# Altium project sensors_0v2.PrjPCB
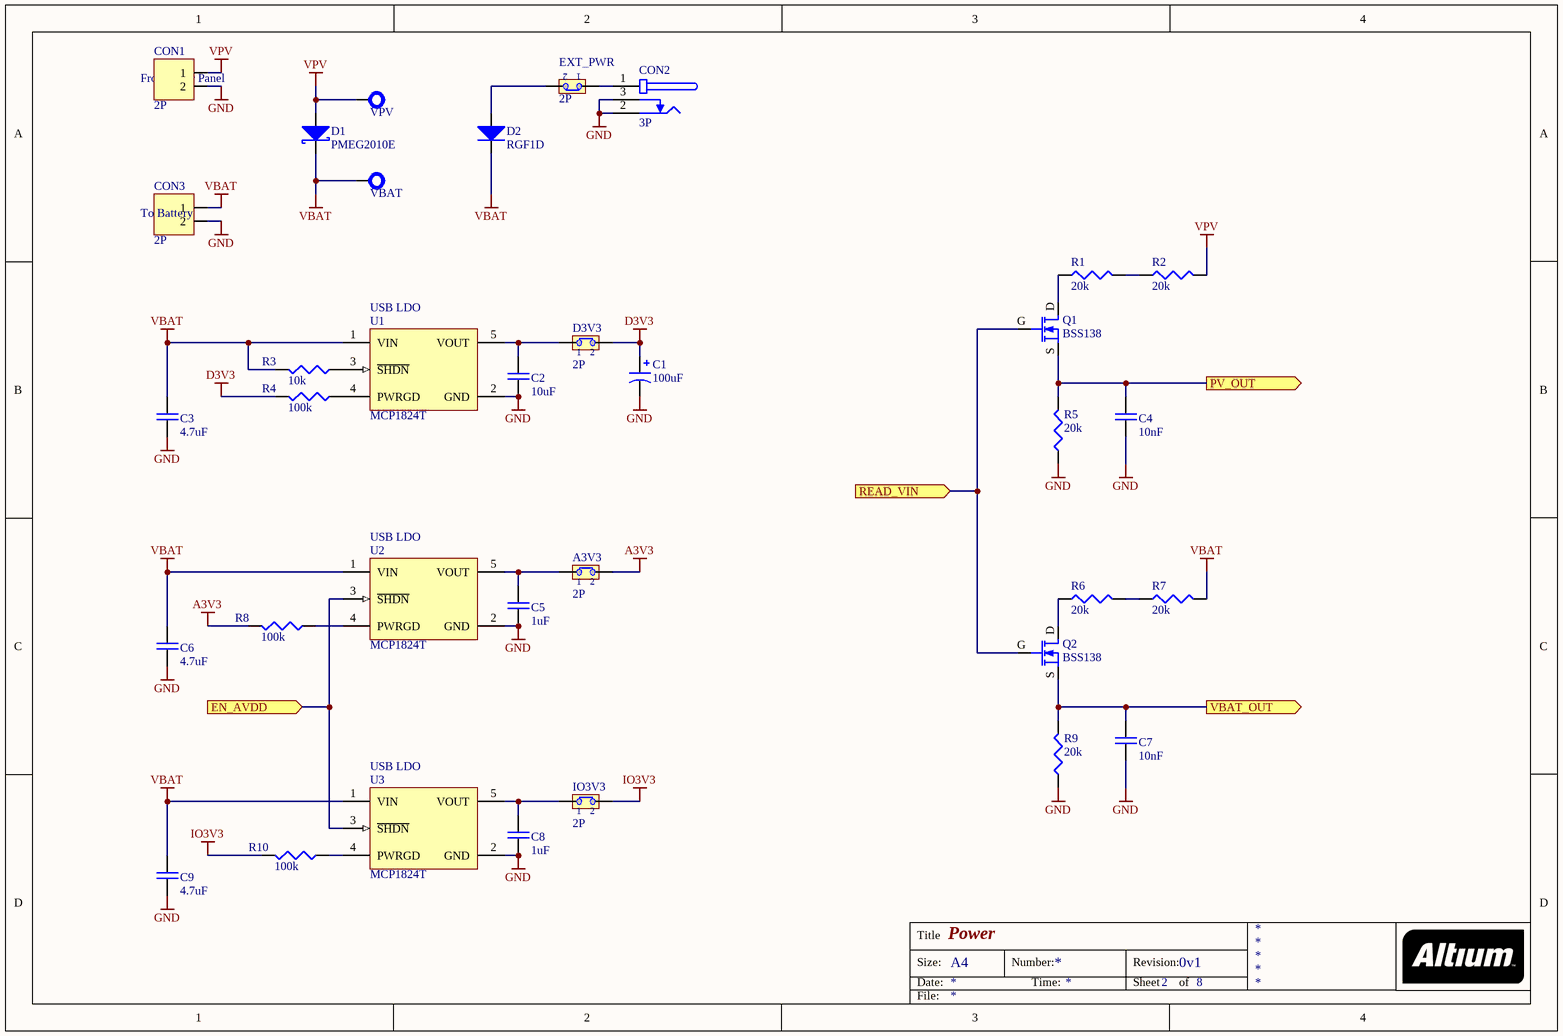
[diagram p0: power.SchDoc]
5 sheets, 144 parts. Net scope: flat (ports and power ports of the same name join across sheets).
Board file: sensors_0v2.PcbDoc
Sheets:
  power.SchDoc
  atmega128rf.SchDoc
  humidity.SchDoc
  uv.SchDoc
  weatherstation.SchDoc

## Sheet power.SchDoc: Power
size A4; CheckedBy: rrodrigu; Author: Satxo; CompanyName: Satxo; Revision: 0v1; SheetNumber: 2; SheetTotal: 8; ProjectName: Basestation

### Parts
A3V3  2P  [SIP-2]
C1  100uF  [RADIAL-2.5MM]
C2  10uF  [0805]
C3  4.7uF  [0805]
C4  10nF  [0603]
C5  1uF  [0805]
C6  4.7uF  [0805]
C7  10nF  [0603]
C8  1uF  [0805]
C9  4.7uF  [0805]
CON1  2P  [JST-2MM]
CON2  3P  [JACKPOW/PD-2.5MM-TH]
CON3  2P  [INTERLOCK2-5MM]
D1  PMEG2010E  [SOD-123]
D2  RGF1D  [DO-214BA]
D3V3  2P  [SIP-2]
EXT_PWR  2P  [SIP-2]
IO3V3  2P  [SIP-2]
Q1  BSS138  [SOT-23@GSD]
Q2  BSS138  [SOT-23@GSD]
R1  20k  [0603]
R2  20k  [0603]
R3  10k  [0603]
R4  100k  [0603]
R5  20k  [0603]
R6  20k  [0603]
R7  20k  [0603]
R8  100k  [0603]
R9  20k  [0603]
R10  100k  [0603]
U1  MCP1824T  [SOT-23-5]
U2  MCP1824T  [SOT-23-5]
U3  MCP1824T  [SOT-23-5]
VBAT  Test Point  [TERMINAL]  (value not drawn)  (no BOM)
VPV  Test Point  [TERMINAL]  (value not drawn)  (no BOM)

### Ports
EN_AVDD (in), PV_OUT (out), READ_VIN (in), VBAT_OUT (out)

### Nets
A3V3: A3V3.2 R8.2
D3V3: C1.1(P) D3V3.2 R4.2
GND: C1.2(N) C2.1 C3.1 C4.1 C5.1 C6.1 C7.1 C8.1 C9.1 CON1.2 CON2.2 CON2.3 CON3.2 R5.1 R9.1 U1.2(GND) U2.2(GND) U3.2(GND)
IO3V3: IO3V3.2 R10.2
VBAT: C3.2 C6.2 C9.2 CON3.1 D1.K D2.K R3.2 R7.2 U1.1(VIN) U2.1(VIN) U3.1(VIN) VBAT.1(TP)
VPV: CON1.1 D1.A R2.2 VPV.1(TP)
EN_AVDD: U2.3(~{SHDN}) U3.3(~{SHDN}) ; port EN_AVDD
PV_OUT: C4.2 Q1.S R5.2 ; port PV_OUT
READ_VIN: Q1.G Q2.G ; port READ_VIN
VBAT_OUT: C7.2 Q2.S R9.2 ; port VBAT_OUT
NetA3V3_1: A3V3.1 C5.2 U2.5(VOUT)
NetC2_2: C2.2 D3V3.1 U1.5(VOUT)
NetC8_2: C8.2 IO3V3.1 U3.5(VOUT)
NetCON2_1: CON2.1 EXT_PWR.1
NetD2_A: D2.A EXT_PWR.2
NetQ1_D: Q1.D R1.1
NetQ2_D: Q2.D R6.1
NetR1_2: R1.2 R2.1
NetR3_1: R3.1 U1.3(~{SHDN})
NetR4_1: R4.1 U1.4(PWRGD)
NetR6_2: R6.2 R7.1
NetR8_1: R8.1 U2.4(PWRGD)
NetR10_1: R10.1 U3.4(PWRGD)

### Notes on the sheet
- From Solar Panel
- To Battery
- (near U1) USB LDO
- (near U2) USB LDO
- (near U3) USB LDO
- Title
- Size:
- Date:
- A4
- Number:
- Time:
- Revision:
- Sheet
- of
- File:

### Library data of the parts
A3V3 EXT_PWR IO3V3 = JMP2: 2-pin Jumper; Owner: Nuno Brum; Sub-Type: Connector; STATE1: 1; Assembly: INS; Validation Date: 2006-05-15; Creation Date: 2002-07-17; Status: Valid; Type: Electrical & Mechanical
C1 = CAP POL: Polarized Capacitor; Owner: Nuno Brum; Sub-Type: Tantalum; Assembly: INS; Validation date: 2006-05-15; Creation Date: 2005-04-28; Status: Valid; Type: Capacitor
C2-C9 = CAP: Capacitor; Owner: Nuno Brum; Sub-Type: Ceramic; Assembly: INS; Maximum Voltage: *; Creation Date: 2005-04-28; Status: Valid; Validation date: 2006-05-15; Type: Capacitor
CON1 CON3 = CON02: Connector 2 pins; Owner: Rui Rebelo; Assembly: INS; Sub-Type: Connector; Creation Date: 2005-05-27; Status: Valid; Validation Date: 2006-05-15; Type: Electrical & Mechanical
CON2 = JACK POWER PD: Jack Power with insertion detect; Sub-Type: Connector; Owner: Gonçalo Costa; Assembly: INS; Creation Date: 2005-12-05; Status: New; Type: Electrical & Mechanical
D1 = Diode Schottky: Small Signal Schottky Diode; Owner: Nuno Brum; Assembly: INS; Validation date: 2006-05-15; Creation Date: 2001-06-05; Sub-Type: Schottky; Status: Valid; Model: PMEG2010E; Type: Diode
D2 = Diode: Vishay Standard Avalanche Sinterglass Diode; Owner: Nuno Brum; Sub-Type: Generic; Assembly: INS; Validation date: 2006-05-15; Creation Date: 2001-06-05; Status: Valid; Model: RGF1D; Type: Diode
D3V3 = JMP2: 2-pin Jumper; Owner: Nuno Brum; Sub-Type: Connector; STATE1: 1; Type: Electrical & Mechanical; Assembly: INS; Validation Date: 2006-05-15; Creation Date: 2002-07-17; Status: Valid
Q1 Q2 = MOSFET-N: N-Channel Logic Level Enhancement Mode Field Effect Transistor; pin to pad: 2>3 3>2; Owner: Nuno Brum; Sub-Type: MOSFET; Assembly: INS; Creation Date: 2001-06-05; Status: Valid; Model: BSS138; Type: Transistor
R1-R10 = RES: Resistor; Owner: Nuno Brum; Sub-Type: Generic; Assembly: INS; Validation date: 2006-05-15; Creation Date: 2002-07-17; Status: Valid; Power: *; Type: Resistor
U1-U3 = MCP1824T: 300 mA, Low Voltage, Low Quiescent Current LDO Regulator, 5-Pin SOT-23, Extended Temperature, Tape and Reel; Published: 29-Jan-2009; DatasheetVersion: revA, Aug-2007; PackageVersion: revBB, Aug-2009; PackageReference: SOT-23-OT5; Publisher: Altium Limited; PackageDescription: 5-Lead Plastic Small Outline Transistor (OT) [SOT-23]; Supplier 1: Digi-Key; Supplier Part Number 1: MCP1824T-3302E/OTTR-ND; Supplier 2: Digi-Key; Supplier Part Number 2: MCP1824T-3302E/OTCT-ND; Supplier 3: Digi-Key; Supplier Part Number 3: MCP1824T-3302E/OTDKR-ND; Supplier 4: Farnell; Supplier Part Number 4: 1578387; Code_IPC: SOT23-5; ComponentLink1Description: Datasheet; ComponentLink1URL: http://ww1.microchip.com/downloads/en/DeviceDoc/22070a.pdf; ComponentLink2Description: Packaging Specification; ComponentLink2URL: http://www.microchip.com/stellent/groups/techpub_sg/documents/packagingspec/en012702.pdf; ComponentLink3Description: Microchip.com Home; ComponentLink3URL: http://www.microchip.com/
VBAT VPV = TEST-PROBE: Test/Probe Point; Owner: Nuno Brum; Sub-Type: Mechanical; Assembly: PCB; Validation Date: 2006-05-15; Type: PCB; Creation Date: 2005-06-01; Status: Valid

## Sheet atmega128rf.SchDoc: Microcontroller
size A3; CheckedBy: rrodrigu; Author: Satxo; CompanyName: Satxo; Revision: 0v1; SheetNumber: 3; SheetTotal: 8; ProjectName: Basesation
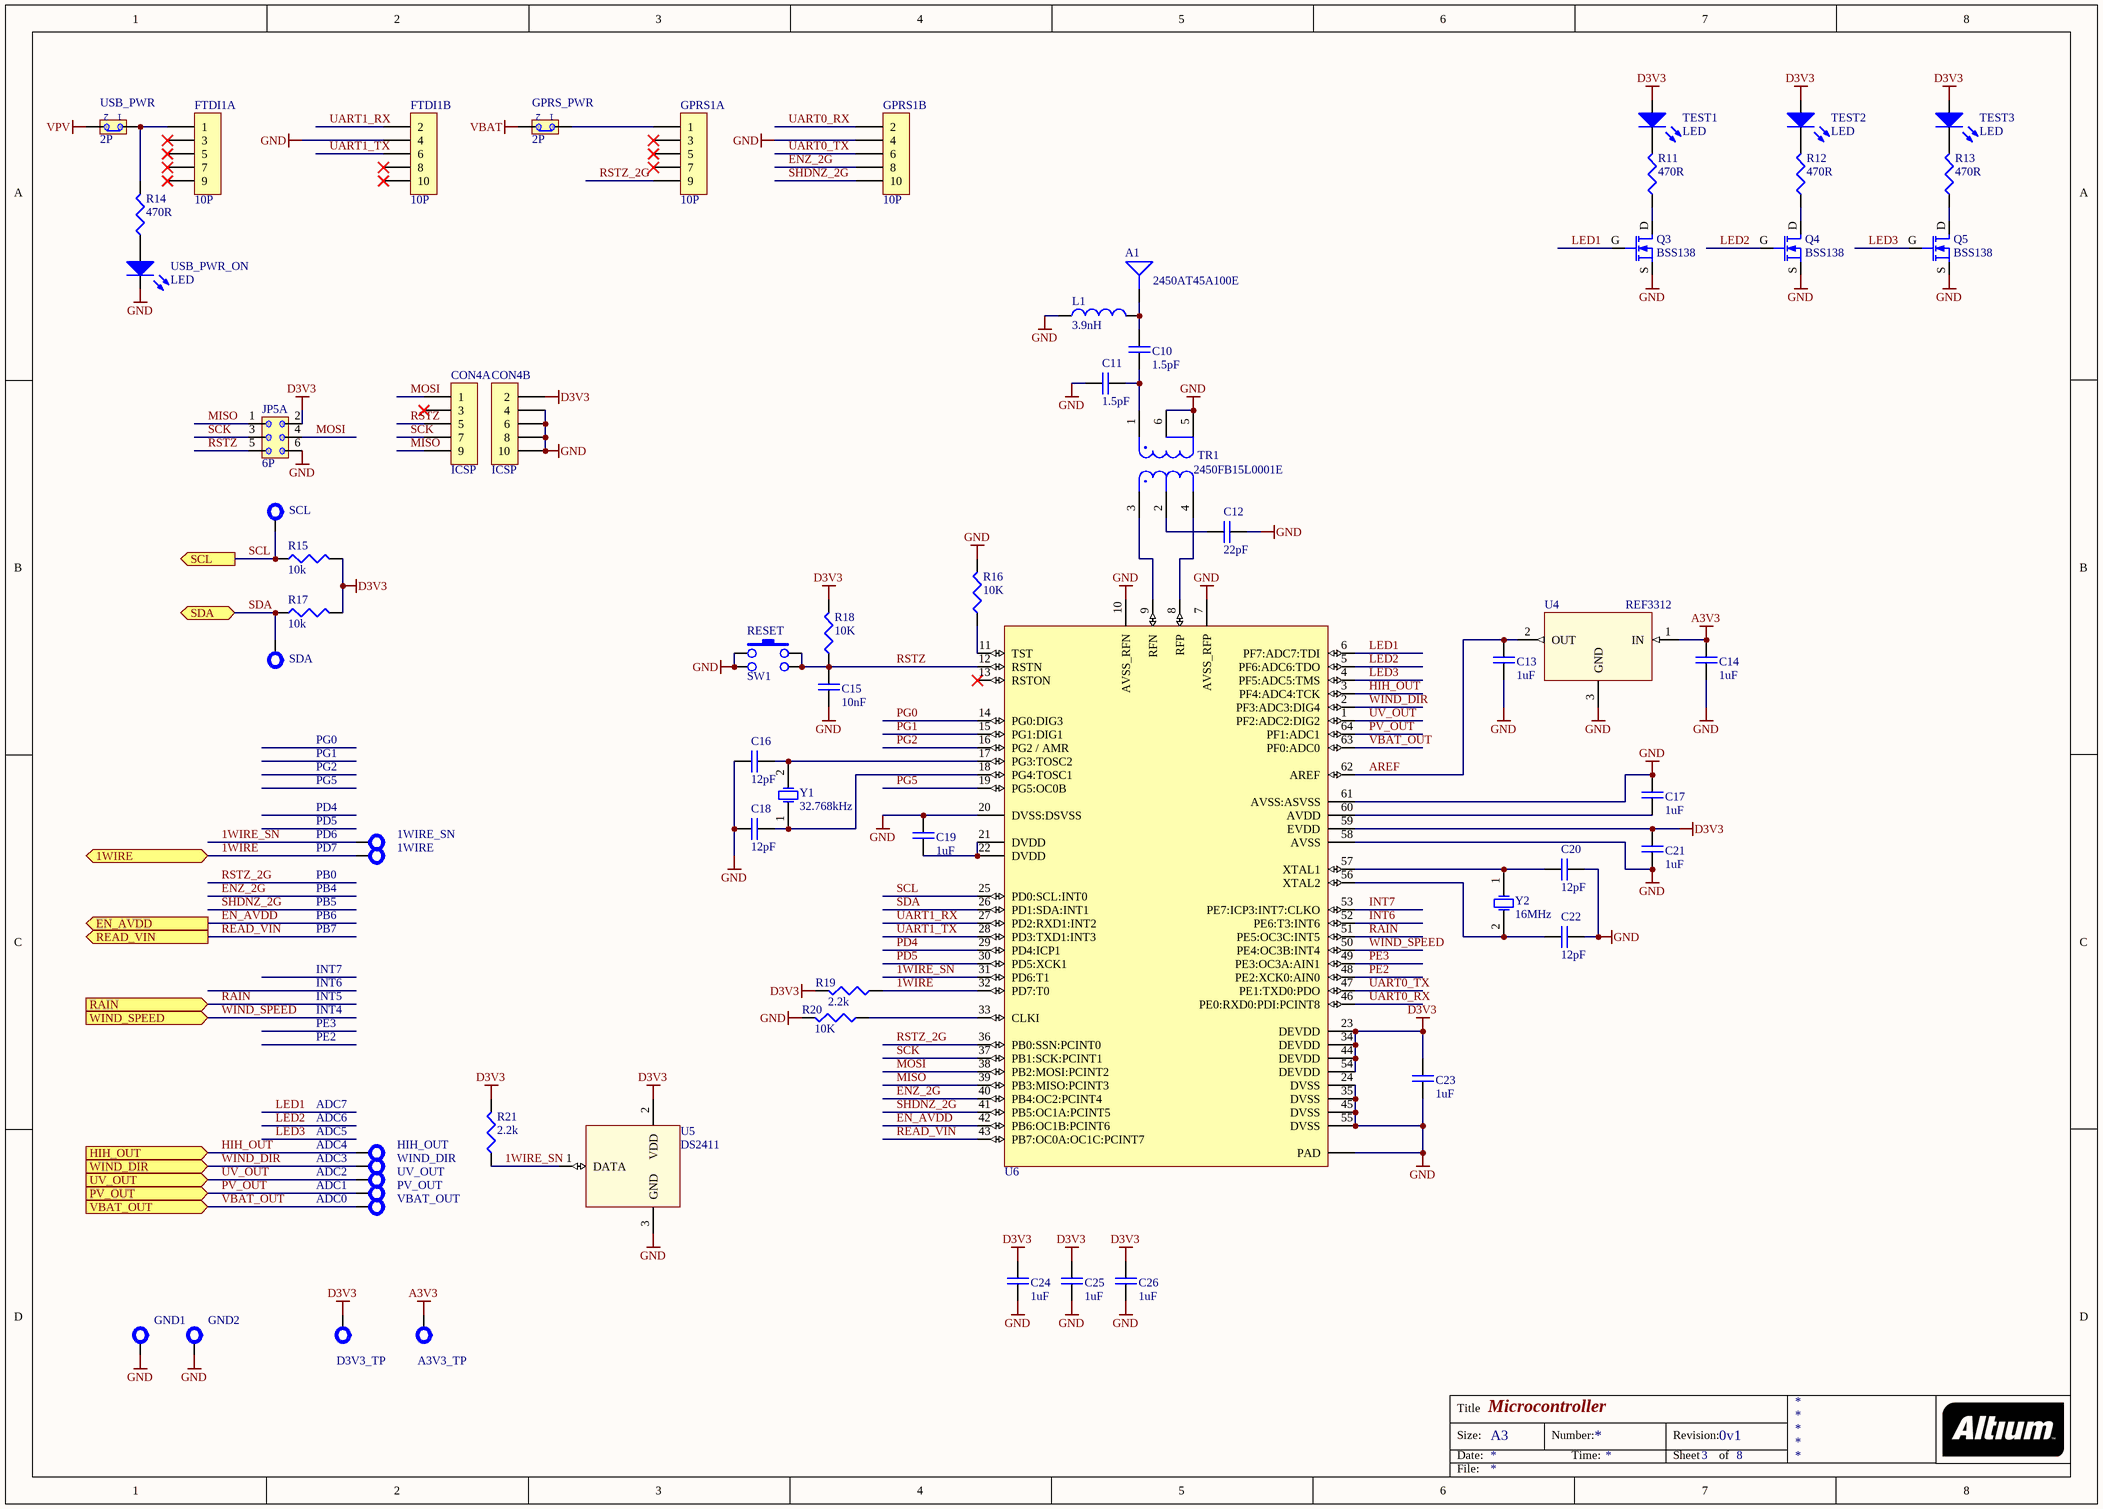
[diagram p1: atmega128rf.SchDoc]

### Parts
1WIRE  Test Point  [TERMINAL]  (value not drawn)  (no BOM)
1WIRE_SN  Test Point  [TERMINAL]  (value not drawn)  (no BOM)
A1  2450AT45A100E  [2450AT45A100E]
A3V3_TP  Test Point  [TERMINAL]  (value not drawn)  (no BOM)
C10  1.5pF  [0402]
C11  1.5pF  [0402]
C12  22pF  [0402]
C13  1uF  [0603]
C14  1uF  [0603]
C15  10nF  [0603]
C16  12pF  [0603]
C17  1uF  [0603]
C18  12pF  [0603]
C19  1uF  [0603]
C20  12pF  [0603]
C21  1uF  [0603]
C22  12pF  [0603]
C23  1uF  [0603]
C24  1uF  [0603]
C25  1uF  [0603]
C26  1uF  [0603]
CON4  ICSP  [IDC-10-F]  (parts A,B of 2)
D3V3_TP  Test Point  [TERMINAL]  (value not drawn)  (no BOM)
FTDI1  10P  [IDC-10-90]  (parts A,B of 2)
GND1  Test Point  [TEST-PROBE2]  (value not drawn)  (no BOM)
GND2  Test Point  [TEST-PROBE2]  (value not drawn)  (no BOM)
GPRS1  10P  [IDC-10-90]  (parts A,B of 2)
GPRS_PWR  2P  [SIP-2]
HIH_OUT  Test Point  [TERMINAL]  (value not drawn)  (no BOM)
JP5  6P  [DIL-6]  (part A of 3)
L1  3.9nH  [0402]
PV_OUT  Test Point  [TERMINAL]  (value not drawn)  (no BOM)
Q3  BSS138  [SOT-23@GSD]
Q4  BSS138  [SOT-23@GSD]
Q5  BSS138  [SOT-23@GSD]
R11  470R  [0603]
R12  470R  [0603]
R13  470R  [0603]
R14  470R  [0603]
R15  10k  [0603]
R16  10K  [0603]
R17  10k  [0603]
R18  10K  [0603]
R19  2.2k  [0603]
R20  10K  [0603]
R21  2.2k  [0603]
RESET  SW1  [MICROSWITCH]
SCL  Test Point  [TERMINAL]  (value not drawn)  (no BOM)
SDA  Test Point  [TERMINAL]  (value not drawn)  (no BOM)
TEST1  LED  [0805@DIODE]
TEST2  LED  [0805@DIODE]
TEST3  LED  [0805@DIODE]
TR1  2450FB15L0001E  [0805@BALUN]
U4  REF3312  [SOT-23]
U5  DS2411  [SOT-23]
U6  ATmega128RFA1  [QFN-64@EP]  (value not drawn)
USB_PWR  2P  [SIP-2]
USB_PWR_ON  LED  [0805@DIODE]
UV_OUT  Test Point  [TERMINAL]  (value not drawn)  (no BOM)
VBAT_OUT  Test Point  [TERMINAL]  (value not drawn)  (no BOM)
WIND_DIR  Test Point  [TERMINAL]  (value not drawn)  (no BOM)
Y1  32.768kHz  [HC-49U]
Y2  16MHz  [HC-49U]

### Ports
1WIRE (bidir), EN_AVDD (out), HIH_OUT (in), PV_OUT (in), RAIN (in), READ_VIN (out), SCL (out), SDA (bidir), UV_OUT (in), VBAT_OUT (in), WIND_DIR (in), WIND_SPEED (in)

### Nets
A3V3: A3V3_TP.1(TP) C14.1 U4.1(IN)
D3V3: C21.2 C23.2 C24.2 C25.2 C26.2 CON4.2 D3V3_TP.1(TP) JP5.2 R15.2 R17.2 R18.2 R19.2 R21.2 TEST1.A TEST2.A TEST3.A U5.2(VDD) U6.23(DEVDD) U6.34(DEVDD) U6.44(DEVDD) U6.54(DEVDD) U6.59(EVDD)
GND: C11.1 C12.2 C13.2 C14.2 C15.2 C16.1 C17.2 C18.1 C19.2 C20.2 C21.1 C22.2 C23.1 C24.1 C25.1 C26.1 CON4.4 CON4.6 CON4.8 CON4.10 FTDI1.4 GND1.1(TP) GND2.1(TP) GPRS1.4 JP5.6 L1.1 Q3.S Q4.S Q5.S R16.2 R20.2 RESET.1 RESET.3 TR1.5(Ground) TR1.6(Ground) U4.3(GND) U5.3(GND) U6.7(AVSS_RFP) U6.10(AVSS_RFN) U6.20(DVSS:DSVSS) U6.24(DVSS) U6.35(DVSS) U6.45(DVSS) U6.55(DVSS) U6.58(AVSS) U6.61(AVSS:ASVSS) U6.PAD USB_PWR_ON.K
VBAT: GPRS_PWR.2
VPV: USB_PWR.2
1WIRE: 1WIRE.1(TP) R19.1 U6.32(PD7:T0) ; port 1WIRE
1WIRE_SN: 1WIRE_SN.1(TP) R21.1 U5.1(DATA) U6.31(PD6:T1)
AREF: C13.1 U4.2(OUT) U6.62(AREF)
EN_AVDD: U6.42(PB6:OC1B:PCINT6) ; port EN_AVDD
ENZ_2G: GPRS1.8 U6.40(PB4:OC2:PCINT4)
HIH_OUT: HIH_OUT.1(TP) U6.3(PF4:ADC4:TCK) ; port HIH_OUT
INT6: U6.52(PE6:T3:INT6)
INT7: U6.53(PE7:ICP3:INT7:CLKO)
LED1: Q3.G U6.6(PF7:ADC7:TDI)
LED2: Q4.G U6.5(PF6:ADC6:TDO)
LED3: Q5.G U6.4(PF5:ADC5:TMS)
MISO: CON4.9 JP5.1 U6.39(PB3:MISO:PCINT3)
MOSI: CON4.1 JP5.4 U6.38(PB2:MOSI:PCINT2)
PD4: U6.29(PD4:ICP1)
PD5: U6.30(PD5:XCK1)
PE2: U6.48(PE2:XCK0:AIN0)
PE3: U6.49(PE3:OC3A:AIN1)
PG0: U6.14(PG0:DIG3)
PG1: U6.15(PG1:DIG1)
PG2: U6.16(PG2_/_AMR)
PG5: U6.19(PG5:OC0B)
PV_OUT: PV_OUT.1(TP) U6.64(PF1:ADC1) ; port PV_OUT
RAIN: U6.51(PE5:OC3C:INT5) ; port RAIN
READ_VIN: U6.43(PB7:OC0A:OC1C:PCINT7) ; port READ_VIN
RSTZ: C15.1 CON4.5 JP5.5 R18.1 RESET.2 RESET.4 U6.12(RSTN)
RSTZ_2G: GPRS1.9 U6.36(PB0:SSN:PCINT0)
SCK: CON4.7 JP5.3 U6.37(PB1:SCK:PCINT1)
SCL: R15.1 SCL.1(TP) U6.25(PD0:SCL:INT0) ; port SCL
SDA: R17.1 SDA.1(TP) U6.26(PD1:SDA:INT1) ; port SDA
SHDNZ_2G: GPRS1.10 U6.41(PB5:OC1A:PCINT5)
UART0_RX: GPRS1.2 U6.46(PE0:RXD0:PDI:PCINT8)
UART0_TX: GPRS1.6 U6.47(PE1:TXD0:PDO)
UART1_RX: FTDI1.2 U6.27(PD2:RXD1:INT2)
UART1_TX: FTDI1.6 U6.28(PD3:TXD1:INT3)
UV_OUT: U6.1(PF2:ADC2:DIG2) UV_OUT.1(TP) ; port UV_OUT
VBAT_OUT: U6.63(PF0:ADC0) VBAT_OUT.1(TP) ; port VBAT_OUT
WIND_DIR: U6.2(PF3:ADC3:DIG4) WIND_DIR.1(TP) ; port WIND_DIR
WIND_SPEED: U6.50(PE4:OC3B:INT4) ; port WIND_SPEED
NetA1_1: A1.1 C10.2 L1.2
NetC10_1: C10.1 C11.2 TR1.1(Unbalanced_Port)
NetC12_1: C12.1 TR1.2(DC_Feed_+_RF_GND)
NetC16_2: C16.2 U6.17(PG3:TOSC2) Y1.2(OSC2)
NetC17_1: C17.1 U6.60(AVDD)
NetC18_2: C18.2 U6.18(PG4:TOSC1) Y1.1(OSC1)
NetC19_1: C19.1 U6.21(DVDD) U6.22(DVDD)
NetC20_1: C20.1 U6.57(XTAL1) Y2.1(OSC1)
NetC22_1: C22.1 U6.56(XTAL2) Y2.2(OSC2)
NetFTDI1_1: FTDI1.1 R14.2 USB_PWR.1
NetGPRS1_1: GPRS1.1 GPRS_PWR.1
NetQ3_D: Q3.D R11.1
NetQ4_D: Q4.D R12.1
NetQ5_D: Q5.D R13.1
NetR11_2: R11.2 TEST1.K
NetR12_2: R12.2 TEST2.K
NetR13_2: R13.2 TEST3.K
NetR14_1: R14.1 USB_PWR_ON.A
NetR16_1: R16.1 U6.11(TST)
NetR20_1: R20.1 U6.33(CLKI)
NetTR1_3: TR1.3(Balanced_Port) U6.9(RFN)
NetTR1_4: TR1.4(Balanced_Port) U6.8(RFP)

Not connected (* = marked no-connect by the designer): CON4 3*; FTDI1 3* 5* 7* 8* 9* 10*; GPRS1 3* 5* 7*; U6 13(RSTON)*

### Notes on the sheet
- PG0
- PG1
- PG2
- PG5
- PD4
- PD5
- PD6
- PD7
- PB0
- PB4
- PB5
- PB6
- INT6
- INT7
- PB7
- PE2
- PE3
- INT4
- INT5
- ADC6
- ADC7
- ADC1
- ADC2
- ADC3
- ADC4
- ADC5
- ADC0
- Title
- Size:
- Date:
- A3
- Number:
- Time:
- Revision:
- Sheet
- of
- File:

### Library data of the parts
1WIRE 1WIRE_SN A3V3_TP GND1 GND2 HIH_OUT PV_OUT SCL SDA UV_OUT VBAT_OUT WIND_DIR = TEST-PROBE: as VBAT on sheet power; Validation Date: 2006-05-15; Type: PCB; Creation Date: 2005-06-01; Status: Valid
A1 = Antenna SE: ANTENNA
C10-C26 = CAP: as C2 on sheet power; Maximum Voltage: *; Creation Date: 2005-04-28; Status: Valid; Validation date: 2006-05-15; Type: Capacitor
CON4 FTDI1 GPRS1 = CON10: Connector 10 Pins; Owner: António Silva; Assembly: INS; Sub-Type: Connector; Creation Date: 2005-11-21; Status: Valid; Validation Date: 2006-05-15; Type: Electrical & Mechanical
D3V3_TP = TEST-PROBE: Test/Probe Point; Owner: Nuno Brum; Type: PCB; Sub-Type: Mechanical; Validation Date: 2006-05-15; Creation Date: 2005-06-01; Status: Valid; Assembly: PCB
GPRS_PWR USB_PWR = JMP2: as A3V3 on sheet power; Validation Date: 2006-05-15; Creation Date: 2002-07-17; Status: Valid; Type: Electrical & Mechanical
JP5 = JMP6: 6-Pin Jumper; Sub-Type: Connector; Owner: Rui Rebelo; Assembly: INS; Creation Date: 2005-07-17; Status: Valid; Validation Date: 2006-05-15; Type: Electrical & Mechanical
L1 = IND: Inductor; Owner: Nuno Brum; Sub-Type: Generic; Assembly: INS; Validation date: 2006-05-15; Creation Date: 2002-07-17; Status: Valid; Type: Inductor
Q3-Q5 = MOSFET-N: N-Channel Logic Level Enhancement Mode Field Effect Transistor; pin to pad: 2>3 3>2; Owner: Nuno Brum; Sub-Type: MOSFET; Assembly: INS; Creation Date: 2001-06-05; Status: Valid; Model: BSS138; Type: Transistor
R11-R21 = RES: as R1 on sheet power; Validation date: 2006-05-15; Creation Date: 2002-07-17; Status: Valid; Power: *; Type: Resistor
RESET = SW1: Switch Push Button; Owner: Nuno Brum; Assembly: INS; Validation Date: 2006-05-15; Sub-Type: Switch; Creation Date: 2002-07-17; Status: Valid; Type: Electrical & Mechanical
TEST1-TEST3 USB_PWR_ON = LED: Light emitting diode; Owner: Nuno Brum; Assembly: INS; Creation Date: 2001-06-05; Sub-Type: LED; Status: Valid; Validation date: 2006-05-15; Model: LED; Type: Diode
TR1 = 2450FB15L0001E: FILTER BALUN ATMEL 2.45GHZ; Owner: Rui Rebelo; Sub-Type: Transformer; Type: Electrical & Mechanical; Assembly: INS; Creation Date: 2002-07-25; Status: New
U4 = REF3312: Voltage Reference 1.25V, 30ppm/degC, 5mA; Type: IC; Creation Date: 2012-12-09
U5 = DS2411: Silicon Serial Number; Type: IC; Creation Date: 2012-12-10
U6 = ATmega128RFA1: 802.15.4 compliant AVR transceiver; verified by: vlarsen; verified date: 2010-12-05; Status: Verified
Y1 Y2 = Crystal Oscillator: Published: 17-Jul-2002; DatasheetDocument: 18-Apr-2000; PackageReference: CSM-7; Publisher: Altium Limited; ComponentLink1Description: Manufacturer Link; ComponentLink1URL: http://www.ecsxtal.com/; ComponentLink2Description: Datasheet; ComponentLink2URL: http://www.ecsxtal.com/pdf3/CSM_7.pdf

## Sheet humidity.SchDoc: Humidity Sensors
size A4; CheckedBy: rrodrigu; Author: Satxo; CompanyName: Satxo; Revision: 0v1; SheetNumber: 4; SheetTotal: 8; ProjectName: Basestation
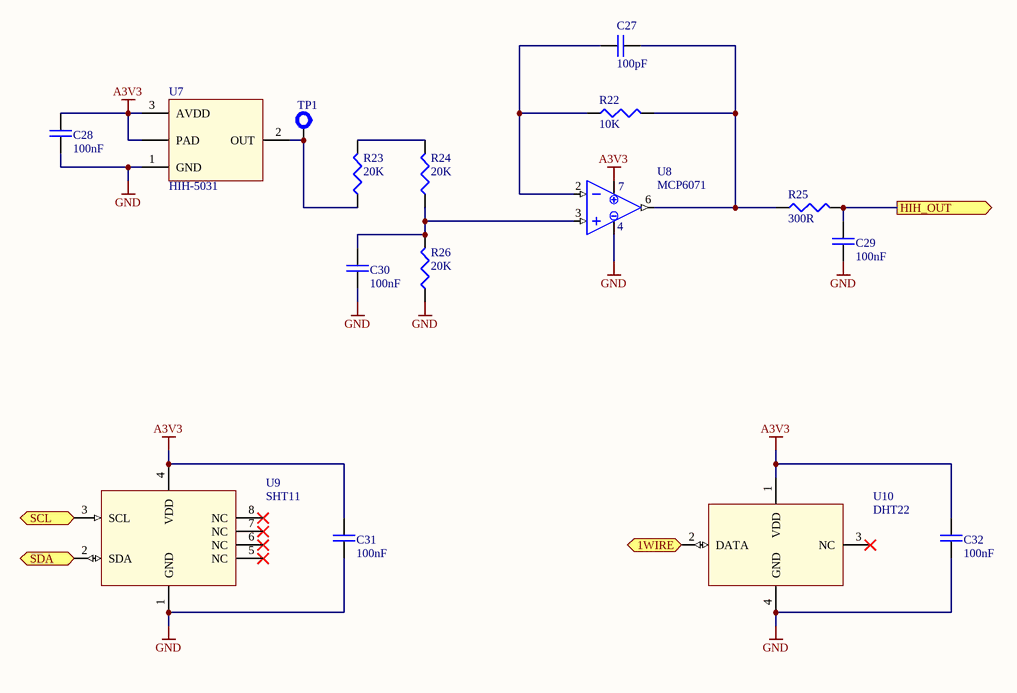
[diagram p2: humidity.SchDoc]

### Parts
C27  100pF  [0603]
C28  100nF  [0603]
C29  100nF  [0603]
C30  100nF  [0603]
C31  100nF  [0603]
C32  100nF  [0603]
R22  10K  [0603]
R23  20K  [0603]
R24  20K  [0603]
R25  300R  [0603]
R26  20K  [0603]
TP1  Test Point  [TERMINAL]  (value not drawn)  (no BOM)
U7  HIH-5031  [HIH]
U8  MCP6071  [SOIC-8]
U9  SHT11  [SHT]
U10  DHT22  [DHT22]

### Ports
1WIRE (bidir), HIH_OUT (out), SCL (in), SDA (bidir)

### Nets
A3V3: C28.2 C31.2 C32.2 U7.3(AVDD) U7.PAD U8.7(VDD) U9.4(VDD) U10.1(VDD)
GND: C28.1 C29.1 C30.1 C31.1 C32.1 R26.1 U7.1(GND) U8.4(VSS) U9.1(GND) U10.4(GND)
1WIRE: U10.2(DATA) ; port 1WIRE
HIH_OUT: C29.2 R25.2 ; port HIH_OUT
SCL: U9.3(SCL) ; port SCL
SDA: U9.2(SDA) ; port SDA
NetC27_1: C27.1 R22.1 U8.2(INN)
NetC27_2: C27.2 R22.2 R25.1 U8.6(VOUT)
NetC30_2: C30.2 R24.1 R26.2 U8.3(INP)
NetR23_1: R23.1 TP1.1(TP) U7.2(OUT)
NetR23_2: R23.2 R24.2

Not connected (* = marked no-connect by the designer): U9 5(NC)* 6(NC)* 7(NC)* 8(NC)*; U10 3(NC)*

### Notes on the sheet
- Title
- Size:
- Date:
- A4
- Number:
- Time:
- Revision:
- Sheet
- of
- File:

### Library data of the parts
C27-C32 = CAP: as C2 on sheet power; Maximum Voltage: *; Creation Date: 2005-04-28; Status: Valid; Validation date: 2006-05-15; Type: Capacitor
R22-R26 = RES: as R1 on sheet power; Validation date: 2006-05-15; Creation Date: 2002-07-17; Status: Valid; Power: *; Type: Resistor
TP1 = TEST-PROBE: as VBAT on sheet power; Validation Date: 2006-05-15; Type: PCB; Creation Date: 2005-06-01; Status: Valid
U7 = HIH-5031: Low Voltage Humidity Sensor; Type: IC; Creation Date: 2012-03-05
U8 = MCP6V26: Low-Offset Opamp; Type: IC; Creation Date: 2012-03-15
U9 = SHT11: Digital Humidity and Temperature Sensor; Type: IC; Creation Date: 2012-12-08
U10 = DHT22: Digital Humidity and Temperature Sensor; Type: IC; Creation Date: 2012-12-09

## Sheet uv.SchDoc: UV Sensor
size A4; CheckedBy: rrodrigu; Author: Satxo; CompanyName: Satxo; Revision: 0v1; SheetNumber: 7; SheetTotal: 8; ProjectName: Basestation
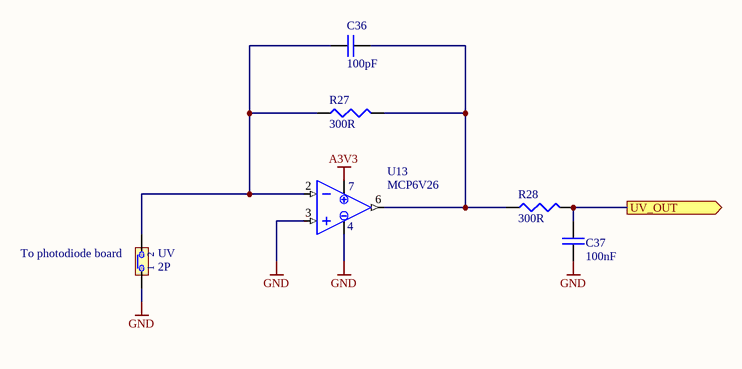
[diagram p3: uv.SchDoc]

### Parts
C36  100pF  [0603]
C37  100nF  [0603]
R27  300R  [0603]
R28  300R  [0603]
U13  MCP6V26  [SOIC-8]
UV  2P  [SIP-2]

### Ports
UV_OUT (out)

### Nets
A3V3: U13.7(VDD)
GND: C37.1 U13.3(INP) U13.4(VSS) UV.1
UV_OUT: C37.2 R28.2 ; port UV_OUT
NetC36_1: C36.1 R27.1 U13.2(INN) UV.2
NetC36_2: C36.2 R27.2 R28.1 U13.6(VOUT)

### Notes on the sheet
- (near UV) To photodiode board
- Title
- Size:
- Date:
- A4
- Number:
- Time:
- Revision:
- Sheet
- of
- File:

### Library data of the parts
C36 C37 = CAP: as C2 on sheet power; Maximum Voltage: *; Creation Date: 2005-04-28; Status: Valid; Validation date: 2006-05-15; Type: Capacitor
R27 R28 = RES: as R1 on sheet power; Validation date: 2006-05-15; Creation Date: 2002-07-17; Status: Valid; Power: *; Type: Resistor
U13 = MCP6V26: Low-Offset Opamp; Type: IC; Creation Date: 2012-03-15
UV = JMP2: as A3V3 on sheet power; Validation Date: 2006-05-15; Creation Date: 2002-07-17; Status: Valid; Type: Electrical & Mechanical

## Sheet weatherstation.SchDoc: Weather Station
size A4; CheckedBy: rrodrigu; Author: Satxo; CompanyName: Satxo; Revision: 0v1; SheetNumber: 8; SheetTotal: 8; ProjectName: Basestation
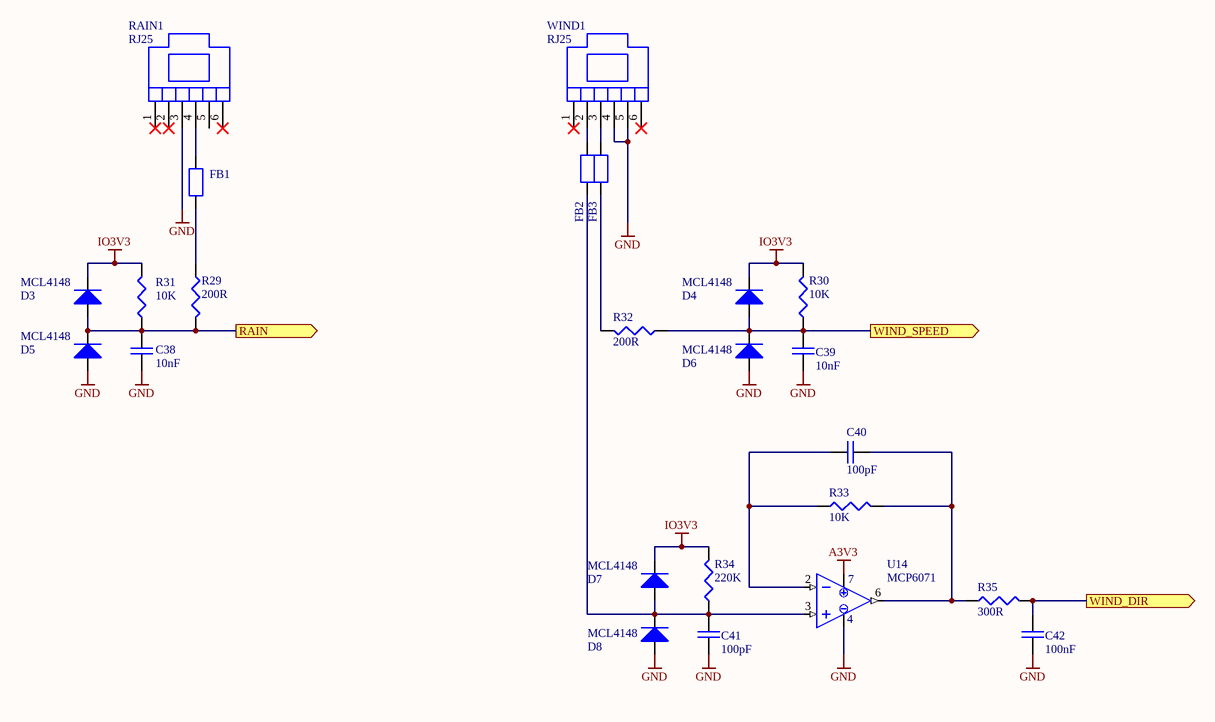
[diagram p4: weatherstation.SchDoc]

### Parts
C38  10nF  [0603]
C39  10nF  [0603]
C40  100pF  [0603]
C41  100pF  [0603]
C42  100nF  [0603]
D3  MCL4148  [0805@DIODE]
D4  MCL4148  [0805@DIODE]
D5  MCL4148  [0805@DIODE]
D6  MCL4148  [0805@DIODE]
D7  MCL4148  [0805@DIODE]
D8  MCL4148  [0805@DIODE]
FB1  150Z_100MHz  [0805]  (value not drawn)
FB2  150Z_100MHz  [0805]  (value not drawn)
FB3  150Z_100MHz  [0805]  (value not drawn)
R29  200R  [0603]
R30  10K  [0603]
R31  10K  [0603]
R32  200R  [0603]
R33  10K  [0603]
R34  220K  [0603]
R35  300R  [0603]
RAIN1  RJ25  [RJ25]
U14  MCP6071  [SOIC-8]
WIND1  RJ25  [RJ25]

### Ports
RAIN (out), WIND_DIR (out), WIND_SPEED (out)

### Nets
A3V3: U14.7(VDD)
GND: C38.1 C39.1 C41.1 C42.1 D5.A D6.A D8.A RAIN1.3 U14.4(VSS) WIND1.4 WIND1.5
IO3V3: D3.K D4.K D7.K R30.2 R31.2 R34.2
RAIN: C38.2 D3.A D5.K R29.2 R31.1 ; port RAIN
WIND_DIR: C42.2 R35.2 ; port WIND_DIR
WIND_SPEED: C39.2 D4.A D6.K R30.1 R32.1 ; port WIND_SPEED
NetC40_1: C40.1 R33.1 U14.2(INN)
NetC40_2: C40.2 R33.2 R35.1 U14.6(VOUT)
NetC41_2: C41.2 D7.A D8.K FB2.2 R34.1 U14.3(INP)
NetFB1_1: FB1.1 R29.1
NetFB1_2: FB1.2 RAIN1.4
NetFB2_1: FB2.1 WIND1.2
NetFB3_1: FB3.1 WIND1.3
NetFB3_2: FB3.2 R32.2

Not connected (* = marked no-connect by the designer): RAIN1 1* 2* 5 6*; WIND1 1* 6*

### Notes on the sheet
- Title
- Size:
- Date:
- A4
- Number:
- Time:
- Revision:
- Sheet
- of
- File:

### Library data of the parts
C38-C42 = CAP: as C2 on sheet power; Maximum Voltage: *; Creation Date: 2005-04-28; Status: Valid; Validation date: 2006-05-15; Type: Capacitor
D3-D8 = Diode: as D2 on sheet power; Validation date: 2006-05-15; Creation Date: 2001-06-05; Status: Valid; Model: MCL4148; Type: Diode
FB1-FB3 = FERRITE-BEAD-AXIAL: Ferrite bead; Sub-Type: Filter; Owner: Sergio Pires; Type: Electrical & Mechanical; Assembly: INS; Creation Date: 2005-10-20; Status: New
R29-R35 = RES: as R1 on sheet power; Validation date: 2006-05-15; Creation Date: 2002-07-17; Status: Valid; Power: *; Type: Resistor
RAIN1 WIND1 = RJ25: RJ25 Connector; Type: Connector; Creation Date: 2012-03-26
U14 = MCP6V26: Low-Offset Opamp; Type: IC; Creation Date: 2012-03-15

## Nets that join several sheets
A3V3: power (A3V3.2 R8.2), atmega128rf (A3V3_TP.1 C14.1 U4.1), humidity (8 pins), uv (U13.7), weatherstation (U14.7)
D3V3: power (C1.1 D3V3.2 R4.2), atmega128rf (22 pins)
GND: power (18 pins), atmega128rf (48 pins), humidity (10 pins), uv (C37.1 U13.3 U13.4 UV.1), weatherstation (11 pins)
IO3V3: power (IO3V3.2 R10.2), weatherstation (6 pins)
VBAT: power (12 pins), atmega128rf (GPRS_PWR.2)
VPV: power (CON1.1 D1.A R2.2 VPV.1), atmega128rf (USB_PWR.2)
1WIRE: atmega128rf (1WIRE.1 R19.1 U6.32), humidity (U10.2)
EN_AVDD: power (U2.3 U3.3), atmega128rf (U6.42)
HIH_OUT: atmega128rf (HIH_OUT.1 U6.3), humidity (C29.2 R25.2)
PV_OUT: power (C4.2 Q1.S R5.2), atmega128rf (PV_OUT.1 U6.64)
RAIN: atmega128rf (U6.51), weatherstation (5 pins)
READ_VIN: power (Q1.G Q2.G), atmega128rf (U6.43)
SCL: atmega128rf (R15.1 SCL.1 U6.25), humidity (U9.3)
SDA: atmega128rf (R17.1 SDA.1 U6.26), humidity (U9.2)
UV_OUT: atmega128rf (U6.1 UV_OUT.1), uv (C37.2 R28.2)
VBAT_OUT: power (C7.2 Q2.S R9.2), atmega128rf (U6.63 VBAT_OUT.1)
WIND_DIR: atmega128rf (U6.2 WIND_DIR.1), weatherstation (C42.2 R35.2)
WIND_SPEED: atmega128rf (U6.50), weatherstation (5 pins)